# Altium schematic sheet RightSide.SchDoc
size A2
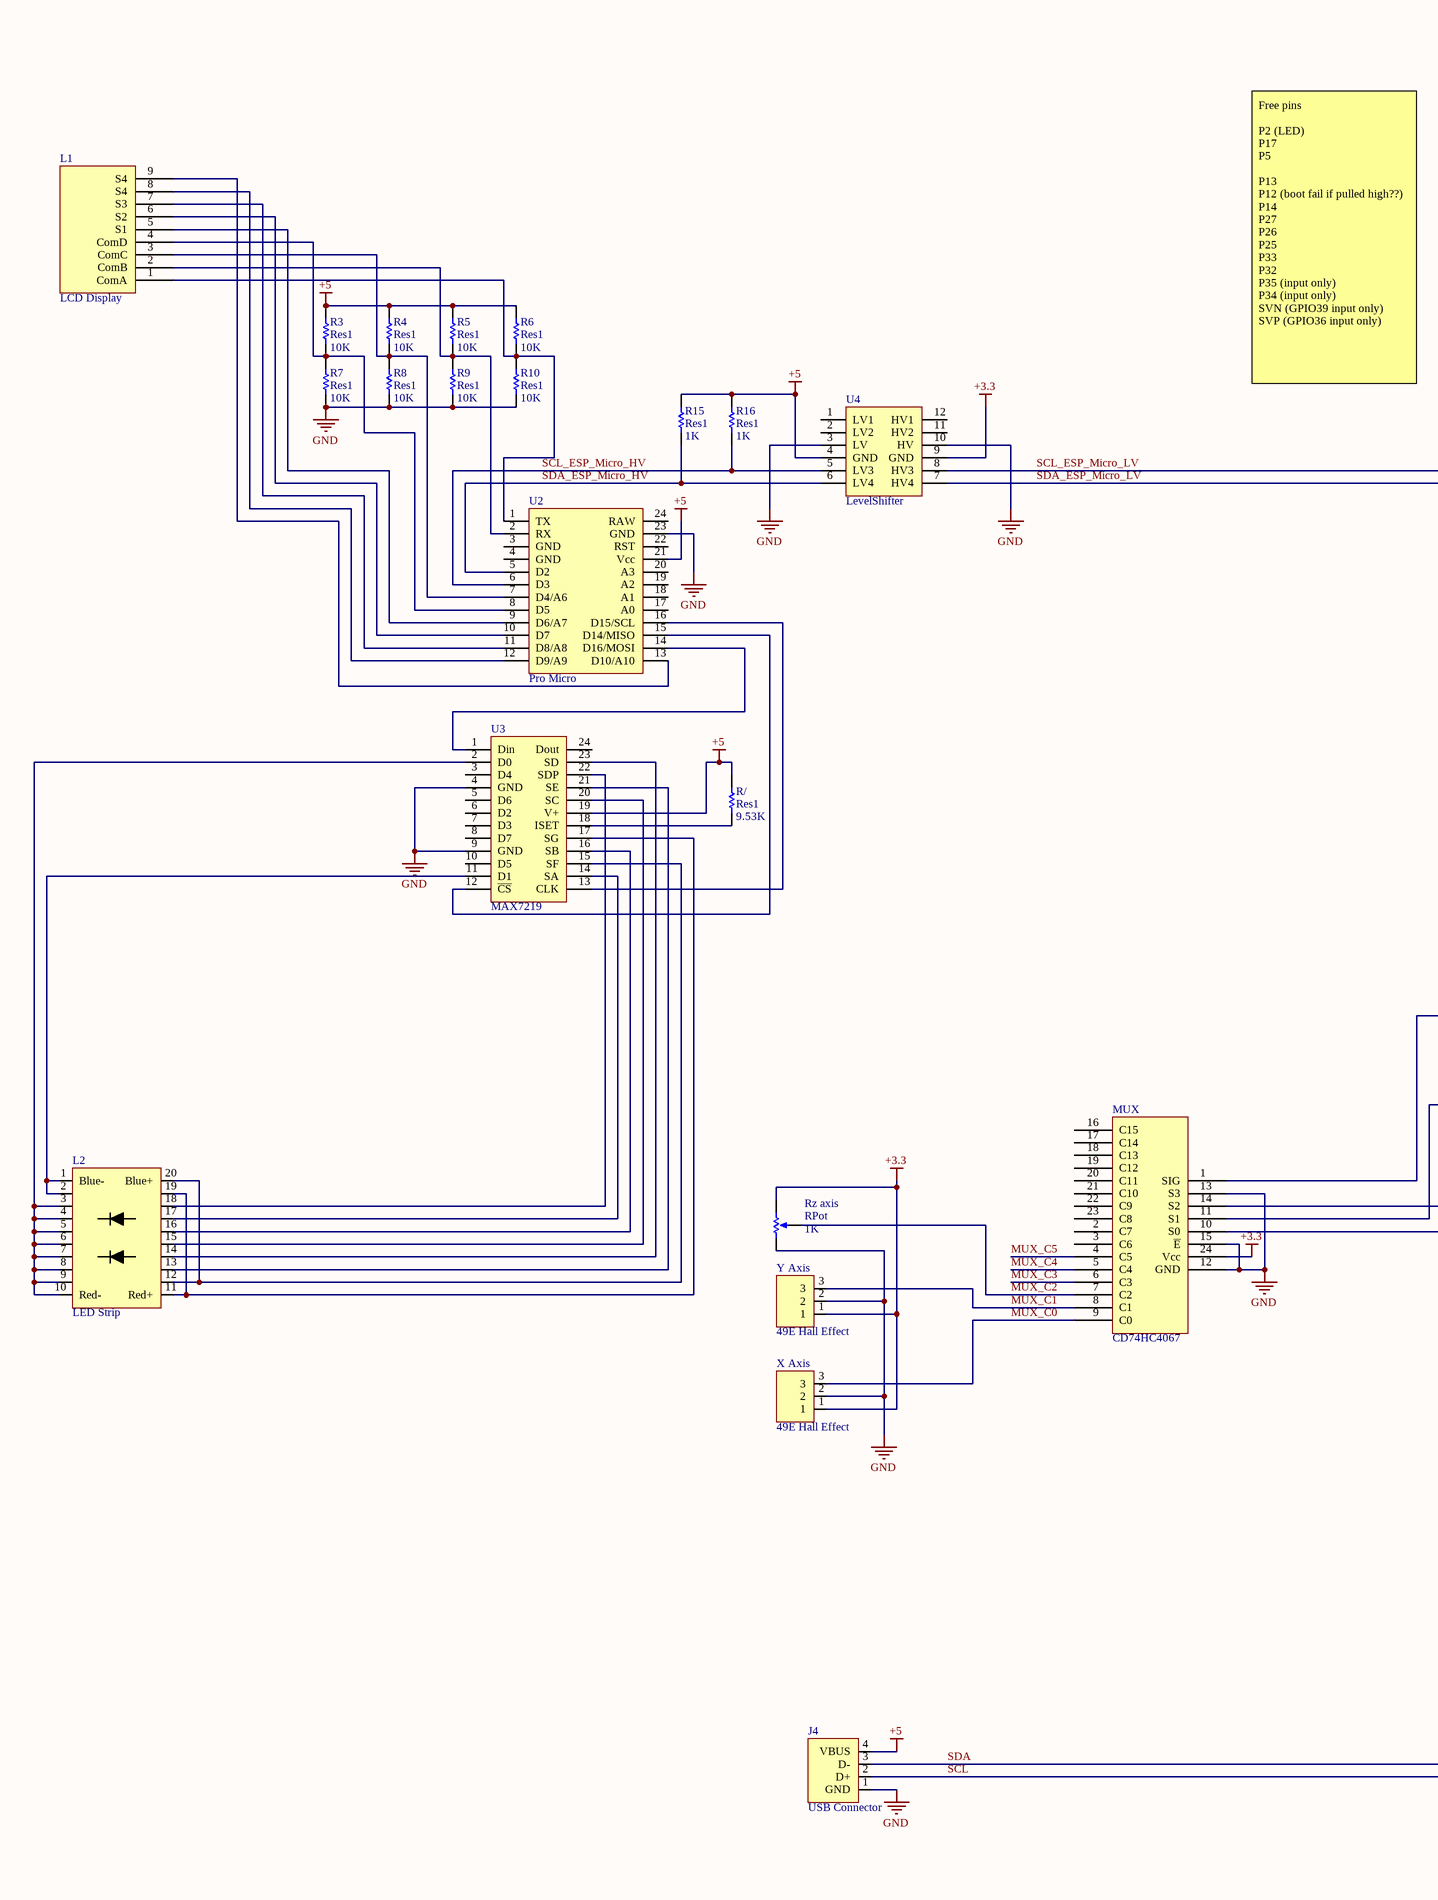
[diagram p0: RightSide.SchDoc, left]
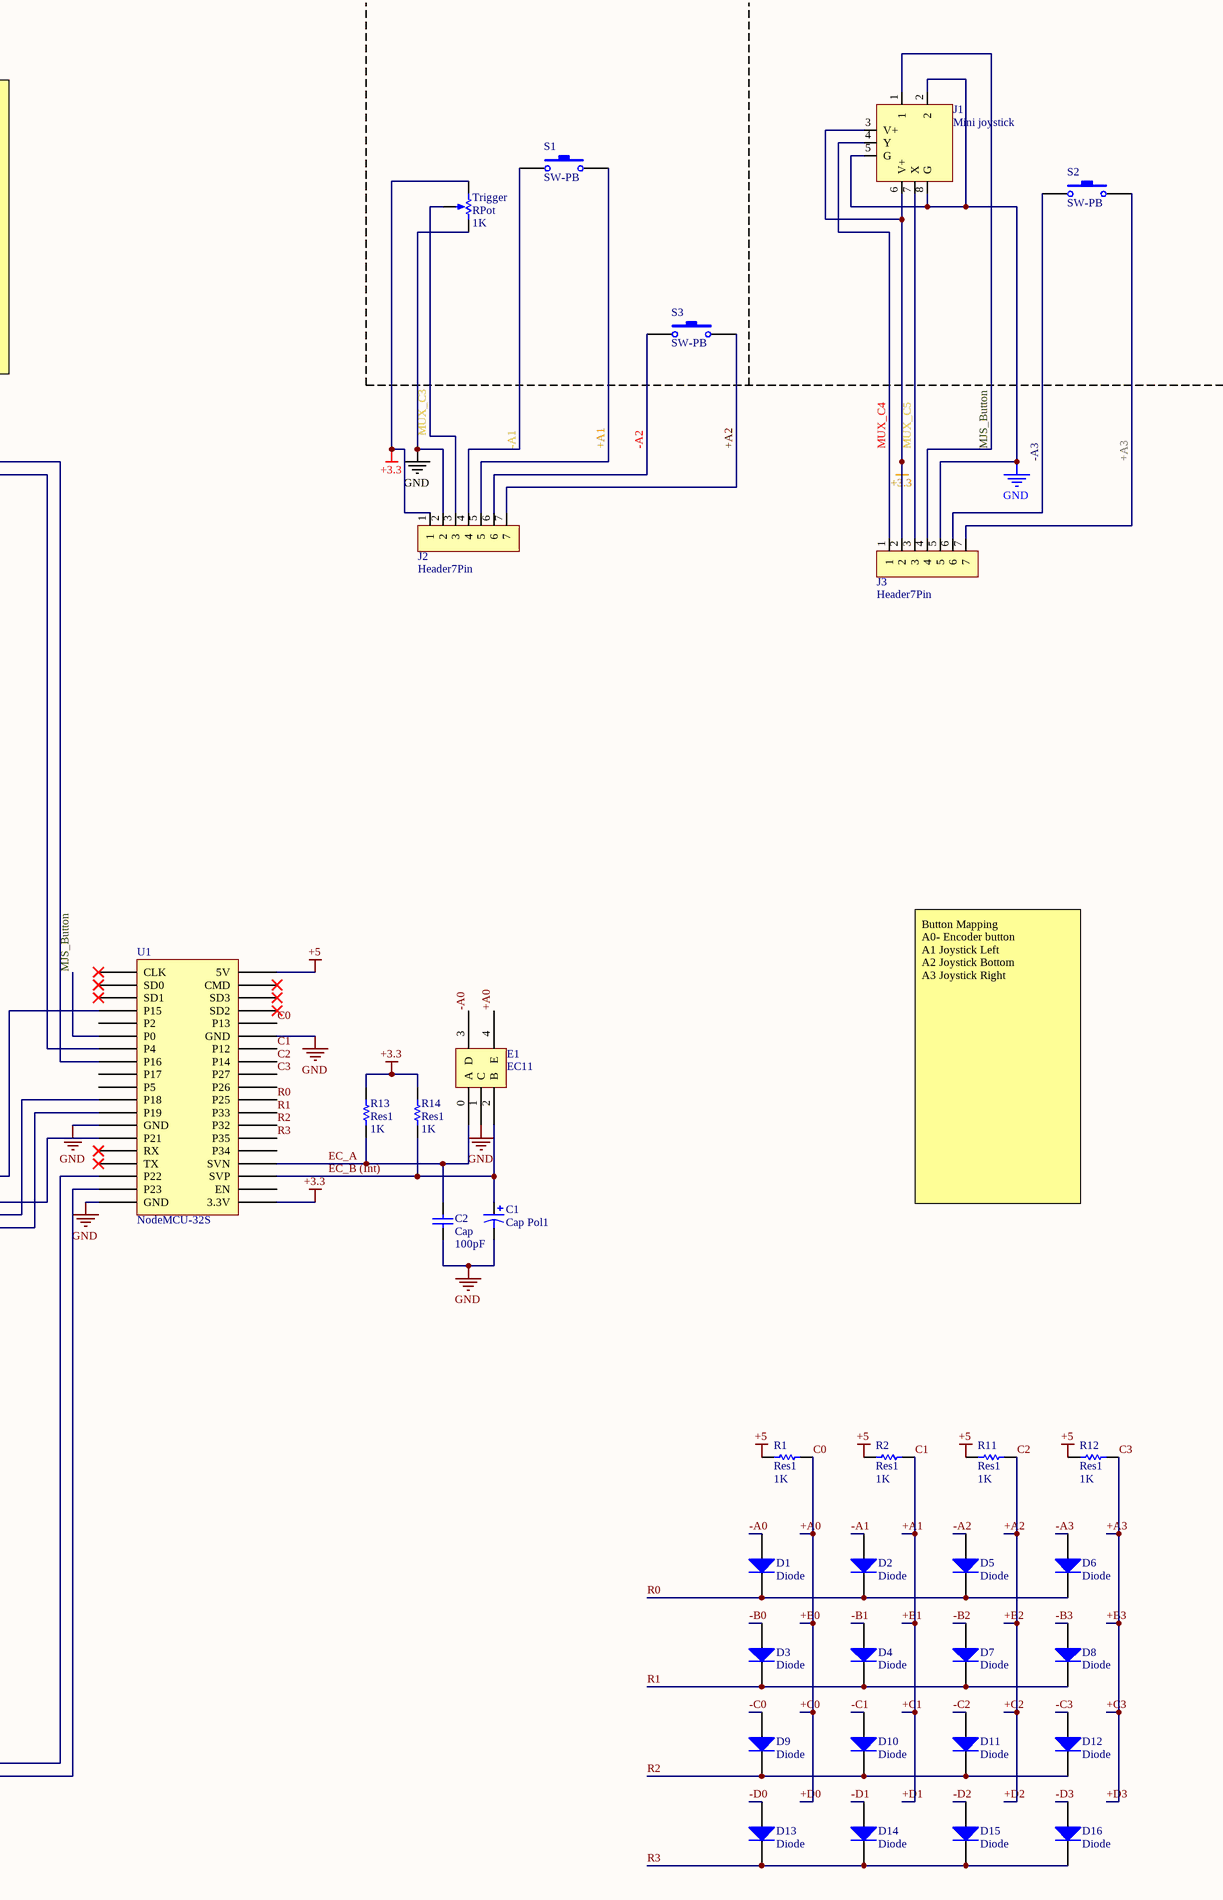
[diagram p1: RightSide.SchDoc, right]

## Parts
C1  Cap Pol1  [RB7.6-15]
C2  Cap  value 100pF  [RAD-0.3]
D1  Diode  [Diode_300mil]
D2  Diode  [Diode_300mil]
D3  Diode  [Diode_300mil]
D4  Diode  [Diode_300mil]
D5  Diode  [Diode_300mil]
D6  Diode  [Diode_300mil]
D7  Diode  [Diode_300mil]
D8  Diode  [Diode_300mil]
D9  Diode  [Diode_300mil]
D10  Diode  [Diode_300mil]
D11  Diode  [Diode_300mil]
D12  Diode  [Diode_300mil]
D13  Diode  [Diode_300mil]
D14  Diode  [Diode_300mil]
D15  Diode  [Diode_300mil]
D16  Diode  [Diode_300mil]
E1  EC11  [Encoder]
J1  Mini joystick  [MiniJoyStick]
J2  Header7Pin  [Header7Pin]
J3  Header7Pin  [Header7Pin]
J4  USB Connector  [USB-B]
L1  LCD Display  [LCD Display]
L2  LED Strip
MUX  CD74HC4067  [CD74HC4067]
R1  Res1  value 1K  [AXIAL-0.3]
R2  Res1  value 1K  [AXIAL-0.3]
R3  Res1  value 10K  [AXIAL-0.3]
R4  Res1  value 10K  [AXIAL-0.3]
R5  Res1  value 10K  [AXIAL-0.3]
R6  Res1  value 10K  [AXIAL-0.3]
R7  Res1  value 10K  [AXIAL-0.3]
R8  Res1  value 10K  [AXIAL-0.3]
R9  Res1  value 10K  [AXIAL-0.3]
R10  Res1  value 10K  [AXIAL-0.3]
R11  Res1  value 1K  [AXIAL-0.3]
R12  Res1  value 1K  [AXIAL-0.3]
R13  Res1  value 1K  [AXIAL-0.3]
R14  Res1  value 1K  [AXIAL-0.3]
R15  Res1  value 1K  [AXIAL-0.3]
R16  Res1  value 1K  [AXIAL-0.3]
R/  Res1  value 9.53K  [AXIAL-0.3]
Rz_axis  RPot  value 1K  [VR5]
S1  SW-PB  [SPST-2]
S2  SW-PB  [SPST-2]
S3  SW-PB  [SPST-2]
Trigger  RPot  value 1K  [VR5]
U1  NodeMCU-32S  [DIP38]
U2  Pro Micro  [DIP24 x 600mil]
U3  MAX7219  [DIP24 x 300mil]
U4  LevelShifter  [LevelShifter]
X_Axis  49E Hall Effect
Y_Axis  49E Hall Effect

## Nets
+3.3: J1.3(V+) J1.6(V+) J2.1 J3.2 MUX.24(Vcc) R13.2 R14.2 Rz_axis.2(BOT) Trigger.1(TOP) U1.20(3.3V) U4.9(GND) X_Axis.1 Y_Axis.1
+5: J4.4(VBUS) R1.1 R2.1 R3.2 R4.2 R5.2 R6.2 R11.1 R12.1 R15.2 R16.2 R/.2 U1.38(5V) U2.21(Vcc) U3.19(V+) U4.4(GND)
GND: C1.2 C2.1 E1.1(C) J1.2 J1.5(G) J1.8(G) J2.2 J3.5 J4.1(GND) MUX.12(GND) MUX.13(S3) MUX.15(~{E}) R7.1 R8.1 R9.1 R10.1 Rz_axis.1(TOP) Trigger.2(BOT) U1.13(GND) U1.19(GND) U1.33(GND) U2.23(GND) U3.4(GND) U3.9(GND) U4.3(LV) U4.10(HV) X_Axis.2 Y_Axis.2
+A0: E1.4(E) R1.2 U1.34(P13)  [also labelled +B0, +C0, +D0, C0]
+A1: J2.5 R2.2 S1.2 U1.32(P12)  [also labelled +B1, +C1, +D1, C1]
+A2: J2.7 R11.2 S3.2 U1.31(P14)  [also labelled +B2, +C2, +D2, C2]
+A3: J3.7 R12.2 S2.2 U1.30(P27)  [also labelled +B3, +C3, +D3, C3]
-A0: D1.1(A) E1.3(D)
-A1: D2.1(A) J2.4 S1.1
-A2: D5.1(A) J2.6 S3.1
-A3: D6.1(A) J3.6 S2.1
-B0: D3.1(A)
-B1: D4.1(A)
-B2: D7.1(A)
-B3: D8.1(A)
-C0: D9.1(A)
-C1: D10.1(A)
-C2: D11.1(A)
-C3: D12.1(A)
-D0: D13.1(A)
-D1: D14.1(A)
-D2: D15.1(A)
-D3: D16.1(A)
EC_A: C2.2 E1.0(A) R13.1 U1.23(SVN)
EC_B (Int): C1.1 E1.2(B) R14.1 U1.22(SVP)
MJS_Button: J1.1 J3.4 U1.6(P0)
MUX_C0: MUX.9(C0) X_Axis.3
MUX_C1: MUX.8(C1) Y_Axis.3
MUX_C2: MUX.7(C2) Rz_axis.3(TAP)
MUX_C3: J2.3 MUX.6(C3) Trigger.3(TAP)
MUX_C4: J1.4(Y) J3.1 MUX.5(C4)
MUX_C5: J1.7(X) J3.3 MUX.4(C5)
R0: D1.2(K) D2.2(K) D5.2(K) D6.2(K) U1.28(P25)
R1: D3.2(K) D4.2(K) D7.2(K) D8.2(K) U1.27(P33)
R2: D9.2(K) D10.2(K) D11.2(K) D12.2(K) U1.26(P32)
R3: D13.2(K) D14.2(K) D15.2(K) D16.2(K) U1.25(P35)
SCL: J4.2(D+) U1.18(P23)
SCL_ESP_Micro_HV: R16.1 U2.6(D3) U4.5(LV3)
SCL_ESP_Micro_LV: U1.8(P16) U4.8(HV3)
SDA: J4.3(D-) U1.17(P22)
SDA_ESP_Micro_HV: R15.1 U2.5(D2) U4.6(LV4)
SDA_ESP_Micro_LV: U1.7(P4) U4.7(HV4)
NetL1_1: L1.1(ComA) R6.1 R10.2 U2.1(TX)
NetL1_2: L1.2(ComB) R5.1 R9.2 U2.2(RX)
NetL1_3: L1.3(ComC) R4.1 R8.2 U2.7(D4/A6)
NetL1_4: L1.4(ComD) R3.1 R7.2 U2.8(D5)
NetL1_5: L1.5(S1) U2.9(D6/A7)
NetL1_6: L1.6(S2) U2.10(D7)
NetL1_7: L1.7(S3) U2.11(D8/A8)
NetL1_8: L1.8(S4) U2.12(D9/A9)
NetL1_9: L1.9(S4) U2.13(D10/A10)
NetL2_1: L2.1(Blue-) L2.2 U3.11(D1)
NetL2_3: L2.3 L2.4 L2.5 L2.6 L2.7 L2.8 L2.9 L2.10(Red-) U3.2(D0)
NetL2_11: L2.11(Red+) L2.19 U3.17(SG)
NetL2_12: L2.12 L2.20(Blue+) U3.15(SF)
NetL2_13: L2.13 U3.21(SE)
NetL2_14: L2.14 U3.23(SD)
NetL2_15: L2.15 U3.20(SC)
NetL2_16: L2.16 U3.16(SB)
NetL2_17: L2.17 U3.14(SA)
NetL2_18: L2.18 U3.22(SDP)
NetMUX_1: MUX.1(SIG) U1.4(P15)
NetMUX_10: MUX.10(S0) U1.12(P19)
NetMUX_11: MUX.11(S1) U1.11(P18)
NetMUX_14: MUX.14(S2) U1.14(P21)
NetR/_1: R/.1 U3.18(ISET)
NetU2_14: U2.14(D16/MOSI) U3.1(Din)
NetU2_15: U2.15(D14/MISO) U3.12(~{CS})
NetU2_16: U2.16(D15/SCL) U3.13(CLK)

Not connected (* = marked no-connect by the designer): MUX 2(C7) 3(C6) 16(C15) 17(C14) 18(C13) 19(C12) 20(C11) 21(C10) 22(C9) 23(C8); U1 1(CLK)* 2(SD0)* 3(SD1)* 5(P2) 9(P17) 10(P5) 15(RX)* 16(TX)* 21(EN) 24(P34) 29(P26) 35(SD2)* 36(SD3)* 37(CMD)*; U2 3(GND) 4(GND) 17(A0) 18(A1) 19(A2) 20(A3) 22(RST) 24(RAW); U3 3(D4) 5(D6) 6(D2) 7(D3) 8(D7) 10(D5) 24(Dout); U4 1(LV1) 2(LV2) 11(HV2) 12(HV1)

## Notes on the sheet
- Free pins
  P2 (LED)
  P17
  P5
  P13
  P12 (boot fail if pulled high??)
  P14
  P27
  P26
  P25
  P33
  P32
  P35 (input only)
  P34 (input only)
  SVN (GPIO39 input only)
  SVP (GPIO36 input only)
- Button Mapping
  A0- Encoder button
  A1 Joystick Left
  A2 Joystick Bottom
  A3 Joystick Right
- Title
- Size:
- Date:
- A3
- Number:
- Time:
- Revision:
- Sheet
- of
- File:

## Library data of the parts
C1 = Cap Pol1: Polarized Capacitor (Radial); Published: 8-Jun-2000; LatestRevisionDate: 17-Jul-2002; LatestRevisionNote: Re-released for DXP Platform.; PackageReference: RB7.6-15; Publisher: Altium Limited; PackageDescription: Polarized Capacitor (Radial); 2 Leads
C2 = Cap: Capacitor; Published: 8-Jun-2000; LatestRevisionDate: 17-Jul-2002; LatestRevisionNote: Re-released for DXP Platform.; PackageReference: RAD-0.3; Publisher: Altium Limited; PackageDescription: Radial Cap, Thru-Hole; 2 Leads; 0.3 in Pin Spacing
D1-D16 = Diode: Default Diode; Published: 8-Jun-2000; LatestRevisionDate: 17-Jul-2002; LatestRevisionNote: Re-released for DXP Platform.; PackageVersion: Sep-1996; PackageReference: SMC; Publisher: Altium Limited; PackageDescription: DO-214-AB/SMC; 2 C-Bend Leads; Body 7.9 x 5.9 mm, inc. leads (LxW); Code_JEDEC: DO-214-AB
E1 = EC11: Rot Encoder / C GND / Pull up A,B
MUX = CD74HC4067: Analog Multiplexer
R1-R16 R/ = Res1: Resistor; Published: 8-Jun-2000; LatestRevisionDate: 17-Jul-2002; LatestRevisionNote: Re-released for DXP Platform.; PackageReference: AXIAL-0.3; Publisher: Altium Limited; PackageDescription: Axial Device, Thru-Hole; 2 Leads; 0.3 in Pin Spacing
Rz_axis Trigger = RPot: Potentiometer; Sim Note: Enter the Resistance value and the set point into parameter fields.; Set Position: 0.5; Published: 8-Jun-2000; LatestRevisionDate: 17-Jul-2002; LatestRevisionNote: Re-released for DXP Platform.; PackageReference: VR5; Publisher: Altium Limited; PackageDescription: Variable Resistor, Thru-Hole; 3 Leads
S1-S3 = SW-PB: Switch; Published: 24-Mar-1999; LatestRevisionDate: 17-Jul-2002; LatestRevisionNote: Re-released for DXP Platform.; PackageReference: SPST-2; Publisher: Altium Limited; PackageDescription: Switch; 2 Leads
U3 = MAX7219: https://datasheets.maximintegrated.com/en/ds/MAX7219-MAX7221.pdf